# Altium schematic sheet 01_shield_stm32.SchDoc: KART : SHIELD STM32
size A4; DrawnBy: JNieto; DocumentNumber: 2; Revision: 1.0; SheetNumber: 2; SheetTotal: 10; Version: V 1.0.0
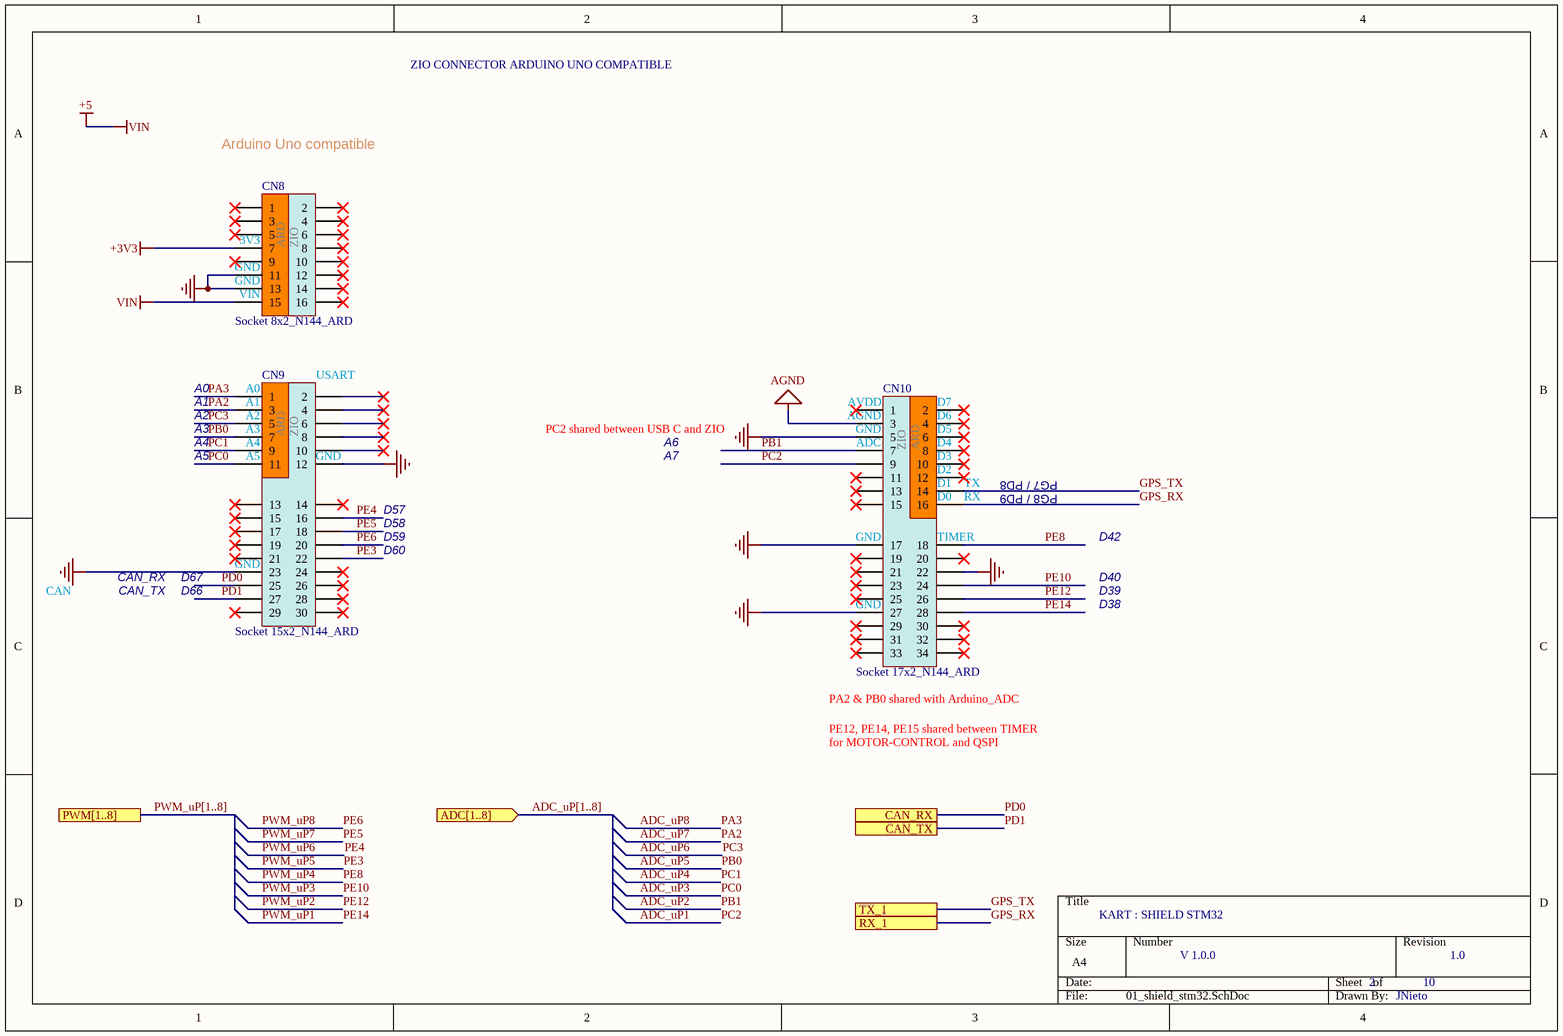
[diagram p0: 01_shield_stm32.SchDoc]

## Parts
CN8  value Socket 8x2_N144_ARD  [CON_SAMTEC_SSW-108-23-X-D_N144_ARD]
CN9  value Socket 15x2_N144_ARD  [CON_SAMTEC_SSW-115-23-X-D_N144_ARD]
CN10  value Socket 17x2_N144_ARD  [CON_SAMTEC_SSW-117-23-X-D_N144_ARD]

## Ports
ADC[1..8] (in), CAN_RX, CAN_TX, PWM[1..8], RX_1, TX_1

## Nets
+3V3: CN8.7
+5: CN8.15  [also labelled VIN]
AGND: CN10.3
GND: CN8.11 CN8.13 CN9.12 CN9.23 CN10.5 CN10.17 CN10.22 CN10.27
ADC_uP1: CN10.9  [also labelled PC2]
ADC_uP2: CN10.7  [also labelled PB1]
ADC_uP3: CN9.11  [also labelled PC0]
ADC_uP4: CN9.9  [also labelled PC1]
ADC_uP5: CN9.7  [also labelled PB0]
ADC_uP6: CN9.5  [also labelled PC3]
ADC_uP7: CN9.3  [also labelled PA2]
ADC_uP8: CN9.1  [also labelled PA3]
GPS_RX: CN10.16 ; port RX_1
GPS_TX: CN10.14 ; port TX_1
PD0: CN9.25 ; port CAN_RX
PD1: CN9.27 ; port CAN_TX
PE3: CN9.22  [also labelled PWM_uP5]
PE4: CN9.16  [also labelled PWM_uP6]
PE5: CN9.18  [also labelled PWM_uP7]
PE6: CN9.20  [also labelled PWM_uP8]
PE8: CN10.18  [also labelled PWM_uP4]
PE10: CN10.24  [also labelled PWM_uP3]
PE12: CN10.26  [also labelled PWM_uP2]
PE14: CN10.28  [also labelled PWM_uP1]

Not connected (* = marked no-connect by the designer): CN8 1* 2* 3* 4* 5* 6* 8* 9* 10* 12* 14* 16*; CN9 2* 4* 6* 8* 10* 13* 14* 15* 17* 19* 21* 24* 26* 28* 29* 30*; CN10 1* 2* 4* 6* 8* 10* 11* 12* 13* 15* 19* 20* 21* 23* 25* 29* 30* 31* 32* 33* 34*

## Buses and harness runs
bus ADC_uP[1..8] = port ADC[1..8]
bus PWM_uP[1..8] = port PWM[1..8]

## Notes on the sheet
- ZIO CONNECTOR ARDUINO UNO COMPATIBLE
- Arduino Uno compatible
- (near CN8) 3V3
- (near CN8) GND
- (near CN8) VIN
- (near CN9) USART
- A0
- A1
- A2
- A3
- A4
- (near CN9) A0
- (near CN9) A1
- (near CN9) A2
- (near CN9) A3
- (near CN9) A4
- PC2 shared between USB C and ZIO
- A6
- (near CN10) GND
- (near CN10) AVDD
- (near CN10) AGND
- (near CN10) ADC
- (near CN10) D7
- (near CN10) D6
- (near CN10) D5
- (near CN10) D4
- A5
- (near CN9) A5
- (near CN9) GND
- D57
- A7
- (near CN10) D2
- (near CN10) D3
- (near CN10) D1
- (near CN10) D0
- (near CN10) TX
- (near CN10) RX
- PG8 / PD9
- PG7 / PD8
- CAN_RX
- D67
- D58
- D59
- D60
- (near CN10) TIMER
- D40
- D42
- CAN
- CAN_TX
- D66
- D38
- D39
- (near CN10) PA2 & PB0 shared with Arduino_ADC
- PE12, PE14, PE15 shared between TIMER for MOTOR-CONTROL and QSPI
- (in symbol MCD-01037) ARD; ZIO
- (in symbol MCD-01040) ARD; ZIO
- (in symbol MCD-01041) ZIO; ARD

## Library data of the parts
CN8 = MCD-01037: Socket, 8x2, 2.54mm, VR, TH, Height 8.51mm/10mm, Low insertion force.; Part_Type: Connector; Manufacturer_Part_Number: SSW-108-23-x-D; Manufacturer: SAMTEC; Provided_By: Subcon; Initial_Board_Reference: MB1361; Remark: Socket dedicated to Arduino+ZIO connector on NUCLEO144; Internal_Part_Number: MCD-01037; Status: Checked; ComponentLink1Description: Datasheet; ComponentLink1URL: http://tunmcdsvn.tun.st.com/Component_Datasheet_Library/Trunk/Connectors/Samtec_SSW-SSQ-series; ECCN_US: n/a; ECCN_EU: n/a
CN9 = MCD-01040: Socket, 15x2, 2.54mm, VR, TH, Height 8.51mm/10mm, Low insertion force.; Part_Type: Connector; Manufacturer_Part_Number: SSW-115-23-x-D; Manufacturer: SAMTEC; Provided_By: Subcon; Initial_Board_Reference: MB1361; Remark: Socket dedicated to Arduino+ZIO connector on NUCLEO144; Internal_Part_Number: MCD-01040; Status: Checked; ComponentLink1Description: Datasheet; ComponentLink1URL: http://tunmcdsvn.tun.st.com/Component_Datasheet_Library/Trunk/Connectors/Samtec_SSW-SSQ-series; ECCN_US: n/a; ECCN_EU: n/a
CN10 = MCD-01041: Socket, 17x2, 2.54mm, VR, TH, Height 8.51mm/10mm, Low insertion force; Part_Type: Connector; Manufacturer_Part_Number: SSW-117-23-x-D; Manufacturer: SAMTEC; Provided_By: Subcon; Initial_Board_Reference: MB1361; Remark: Socket dedicated to Arduino+ZIO connector on NUCLEO144; Internal_Part_Number: MCD-01041; Status: Checked; ComponentLink1Description: Datasheet; ComponentLink1URL: http://tunmcdsvn.tun.st.com/Component_Datasheet_Library/Trunk/Connectors/Samtec_SSW-SSQ-series; ECCN_US: n/a; ECCN_EU: n/a